# EAGLE design ff555_v2 (EAGLE 9.2.2)
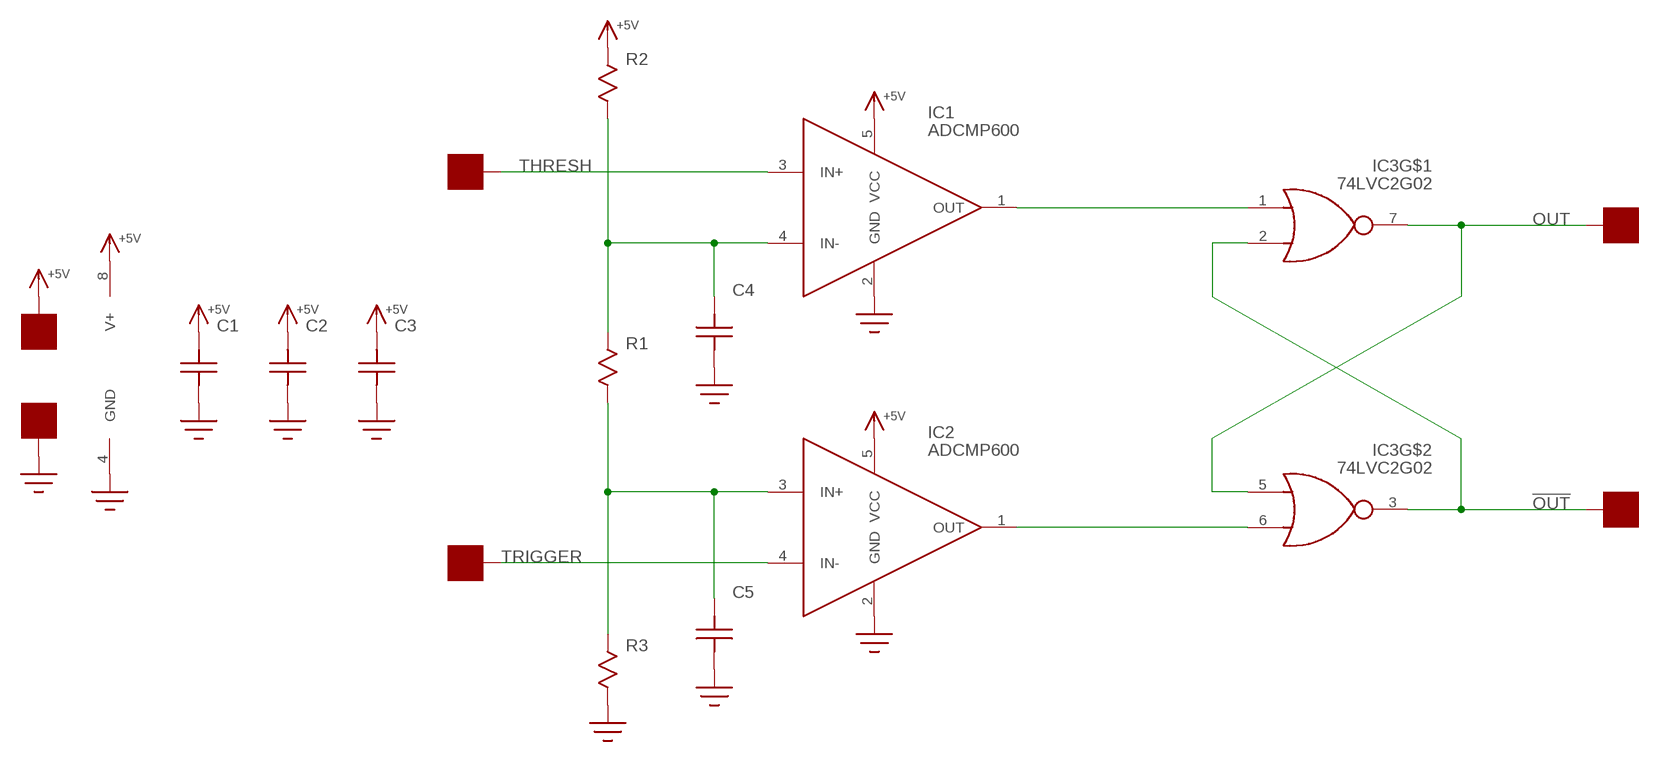
[diagram p0: schematic, sheet 1]

## Parts
C1  C0603  [C0603]
C2  C0603  [C0603]
C3  C0805  [0805]
C4  C0603  [C0603]
C5  C0603  [C0603]
IC1  ADCMP600  [SOT23-5]
IC2  ADCMP600  [SOT23-5]
IC3  74LVC2G02  [TSSOP8]
R1  R1206  [R1206]
R2  R0603  [R0603]
R3  R0603  [R0603]
U$15  PAD100MIL  [PAD_100MIL]
U$16  PAD100MIL  [PAD_100MIL]
U$17  PAD100MIL  [PAD_100MIL]
U$18  PAD100MIL  [PAD_100MIL]
U$19  PAD100MIL  [PAD_100MIL]
U$20  PAD100MIL  [PAD_100MIL]

## Nets
!OUT!: IC3.2(B) IC3.3(Y) U$20.P$1
+5V: C1.P$2 C2.P$2 C3.P$2 IC1.5(VCC) IC2.5(VCC) IC3.8(V+) R2.P$1 U$15.P$1
GND: C1.P$1 C2.P$1 C3.P$1 C4.P$1 C5.P$1 IC1.2(GND) IC2.2(GND) IC3.4(GND) R3.P$2 U$16.P$1
N$1: C4.P$2 IC1.4(IN-) R1.P$1 R2.P$2
N$2: C5.P$2 IC2.3(IN+) R1.P$2 R3.P$1
N$3: IC1.1(OUT) IC3.1(A)
N$4: IC2.1(OUT) IC3.6(B)
OUT: IC3.5(A) IC3.7(Y) U$19.P$1
THRESH: IC1.3(IN+) U$17.P$1
TRIGGER: IC2.4(IN-) U$18.P$1

## Library data of the parts
C1-C5 = yapo:C
IC1 IC2 = yapo:ADCMP600
IC3 = yapo:74LVC2G02
R1-R3 = yapo:R
U$15-U$20 = yapo:PAD

## Board
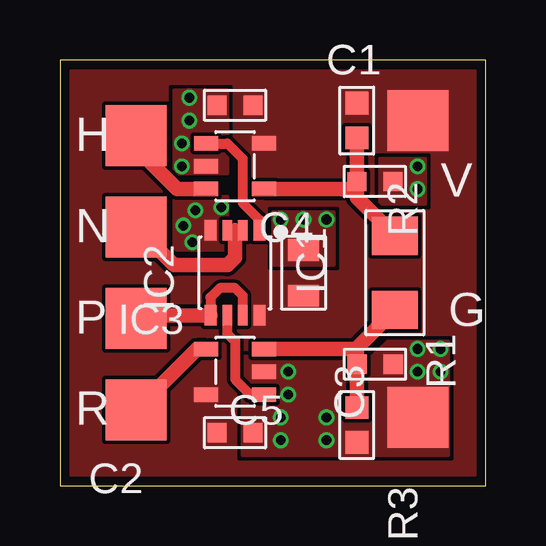
[diagram p1: board, top side]
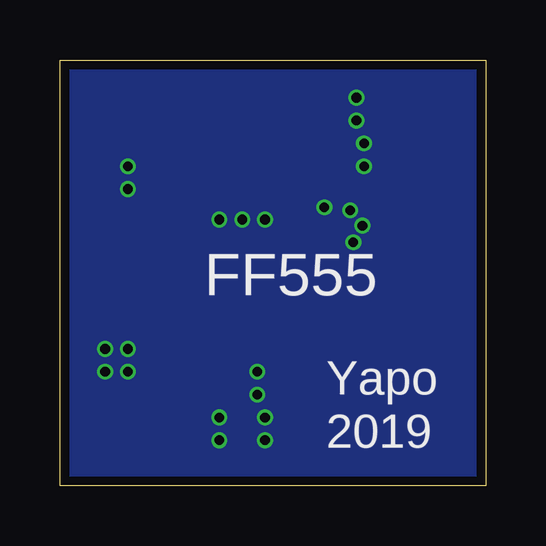
[diagram p2: board, bottom side, seen from below]

Size 17.76 x 17.77 mm. Coordinates in mm from the lower left corner, seen from the top.
Outline: 0,0 17.76,0 17.76,17.77 0,17.77 0,0
Copper layers (1*16): Top 0.035559375mm / dielectric 1.6mm / Bottom 0.035559375mm
Design rules "oshpark-2layer *": minimum track width 6mil, minimum drill 10mil, track to track 6mil, track to pad 6mil, pad to pad 6mil, via to via 6mil, smd to smd 6mil, copper to edge 15mil, drill to drill 6mil, minimum pad ring 5mil, minimum via ring 5mil, stop-mask expansion 2.5mil, vias tented up to drill 30mil, thermal gap 10mil

### Footprints (pad centres in the part's own frame; a part is rotated, then mirrored left to right if it is on the bottom)
C0603 = smd 0.8 x 0.8: P$1 -0.75,0; P$2 0.75,0
0805 = smd 0.9 x 1.3: P$1 -0.95,0; P$2 0.95,0
SOT23-5 = smd 0.6 x 1: 1 -0.95,-1.2; 2 0,-1.2; 3 0.95,-1.2; 4 0.95,1.2; 5 -0.95,1.2
TSSOP8 = smd 0.5 x 0.85: 1 -1.025,-1.775; 4 1.025,-1.775; 5 1.025,1.775; 8 -1.025,1.775 | smd 0.4 x 0.85: 2 -0.325,-1.775; 3 0.325,-1.775; 6 0.325,1.775; 7 -0.325,1.775
R1206 = smd 1.6 x 1.9: P$1 -1.55,0; P$2 1.55,0
R0603 = smd 0.95 x 0.95: P$1 -0.725,0; P$2 0.725,0
PAD_100MIL = smd 2.54 x 2.54: P$1 0,0

### Placement (x,y rotation side)
C1  7.3,15.88 0 top
C2  7.3,2.22 180 top
C3  10.16,8.89 270 top
C4  13.13,12.7 180 top
C5  13.14,5.08 180 top
IC1  7.3,13.34 270 top
IC2  7.3,4.76 90 top
IC3  7.3,8.89 180 top
R1  13.97,8.89 270 top
R2  12.38,15.24 270 top
R3  12.38,2.54 270 top
U$15  14.92,15.24 0 top
U$16  14.92,2.86 0 top
U$17  3.17,14.61 0 top
U$18  3.17,3.17 0 top
U$19  3.17,6.99 0 top
U$20  3.17,10.79 0 top

### Tracks (layer width: path | path; a pad name or v marks a point on that pad's centre or on a via)
!OUT!
  Top 0.406: IC3.3 7.3,10.66 IC3.2
  Top 0.61: 7.3,10.66 7.3,9.53 6.99,9.21 4.76,9.21 U$20.P$1
+5V
  pour Top (rank 2, no thermals): 0,0 17.78,0 17.78,17.78 0,17.78
GND  (via drill 0.4)
  other vias: 14.92,13.34 14.92,12.38 14.92,5.71 14.92,4.76 11.11,11.11 10.16,11.11 9.21,11.11 15.88,5.71 15.88,4.76 11.11,1.91 9.21,2.86 9.21,1.91 9.53,4.76 9.53,3.81 5.65,11.49 5.52,10.16 5.14,10.86 6.73,11.62 5.4,16.19 5.4,15.24 5.08,13.34 5.08,14.29 11.11,2.86
  pour Bottom: 0,0 17.78,0 17.78,17.78 0,17.78
  pour Top (no thermals): 13.34,13.65 13.34,11.75 15.24,11.75 15.24,13.65
  pour Top (no thermals): 11.43,9.21 11.43,9.21 11.43,11.43 8.89,11.43 8.89,9.21
  pour Top (no thermals): 7.62,5.4 7.62,1.27 16.19,1.27 16.19,6.03 13.65,6.03 13.02,5.4
  pour Top (no thermals): 4.76,12.06 6.99,12.06 6.99,9.84 4.76,9.84
  pour Top (no thermals): 6.99,16.51 4.76,16.51 4.76,13.02 6.99,13.02
N$1
  Top 0.61: R2.P$2 C4.P$2 12.38,12.38 | 12.38,12.38 12.38,12.03 R1.P$1 | 12.38,12.38 IC1.4
N$2
  Top 0.61: C5.P$2 12.38,5.09 | C5.P$2 12.39,4.55 12.39,3.91 12.38,3.9 R3.P$1 | C5.P$2 12.39,5.71 IC2.3 | C5.P$2 12.39,5.76 R1.P$2
N$3
  Top 0.406: IC1.1 6.99,14.29 7.62,13.65 7.62,11.8 8.33,11.09 IC3.1
N$4
  Top 0.406: IC3.6 6.98,6.36 7.3,6.03 7.3,4.45 7.93,3.81 IC2.1
OUT
  Top 0.406: IC3.7 7.63,7.93 7.3,8.26 6.67,8.26 6.28,7.87 IC3.5
  Top 0.61: IC3.5 3.31,7.12 U$19.P$1
THRESH
  Top 0.61: IC1.3 4.89,12.38 3.17,14.1 U$17.P$1
TRIGGER
  Top 0.61: IC2.4 5.71,5.71 U$18.P$1

### Text on the board
tPlace: H | V | N | G | P | R
bPlace: FF555 | Yapo | 2019